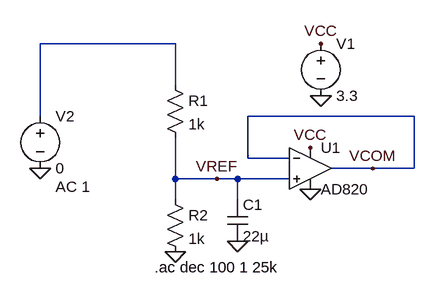
[diagram p0: schematic BiasGeneratorLTSpice.asc]
BiasGeneratorLTSpice.asc, the LTspice schematic file:
Version 4.1
SHEET 1 880 680
WIRE -80 -32 -288 -32
WIRE -80 32 -80 -32
WIRE -288 80 -288 -32
WIRE 288 80 32 80
WIRE 32 144 32 80
WIRE 96 144 32 144
WIRE 224 160 160 160
WIRE 288 160 288 80
WIRE 288 160 224 160
WIRE -80 176 -80 112
WIRE -16 176 -80 176
WIRE 16 176 -16 176
WIRE 96 176 16 176
WIRE -80 208 -80 176
WIRE 16 208 16 176
FLAG 128 192 0
FLAG 144 -32 VCC
FLAG 144 48 0
FLAG -80 288 0
FLAG 16 272 0
FLAG 128 128 VCC
FLAG -16 176 VREF
FLAG 224 160 VCOM
FLAG -288 160 0
SYMBOL res -96 16 R0
SYMATTR InstName R1
SYMATTR Value 1k
SYMBOL res -96 192 R0
SYMATTR InstName R2
SYMATTR Value 1k
SYMBOL cap 0 208 R0
SYMATTR InstName C1
SYMATTR Value 22µ
SYMBOL voltage 144 -48 R0
WINDOW 123 0 0 Left 0
WINDOW 39 0 0 Left 0
SYMATTR InstName V1
SYMATTR Value 3.3
SYMBOL OpAmps\\AD820 128 96 R0
SYMATTR InstName U1
SYMBOL voltage -288 64 R0
WINDOW 123 24 124 Left 2
WINDOW 39 0 0 Left 0
SYMATTR Value2 AC 1
SYMATTR InstName V2
SYMATTR Value 0
TEXT -112 312 Left 2 !.ac dec 100 1 25k

The netlist it stands for:
* BiasGeneratorLTSpice.asc
R1 N001 VREF 1k
R2 VREF 0 1k
C1 VREF 0 22µ
V1 VCC 0 3.3
X§U1 VREF VCOM VCC 0 VCOM AD820  ; pins In+ In- V+ V- OUT
V2 N001 0 0 AC 1
.ac dec 100 1 25k
.backanno
.end